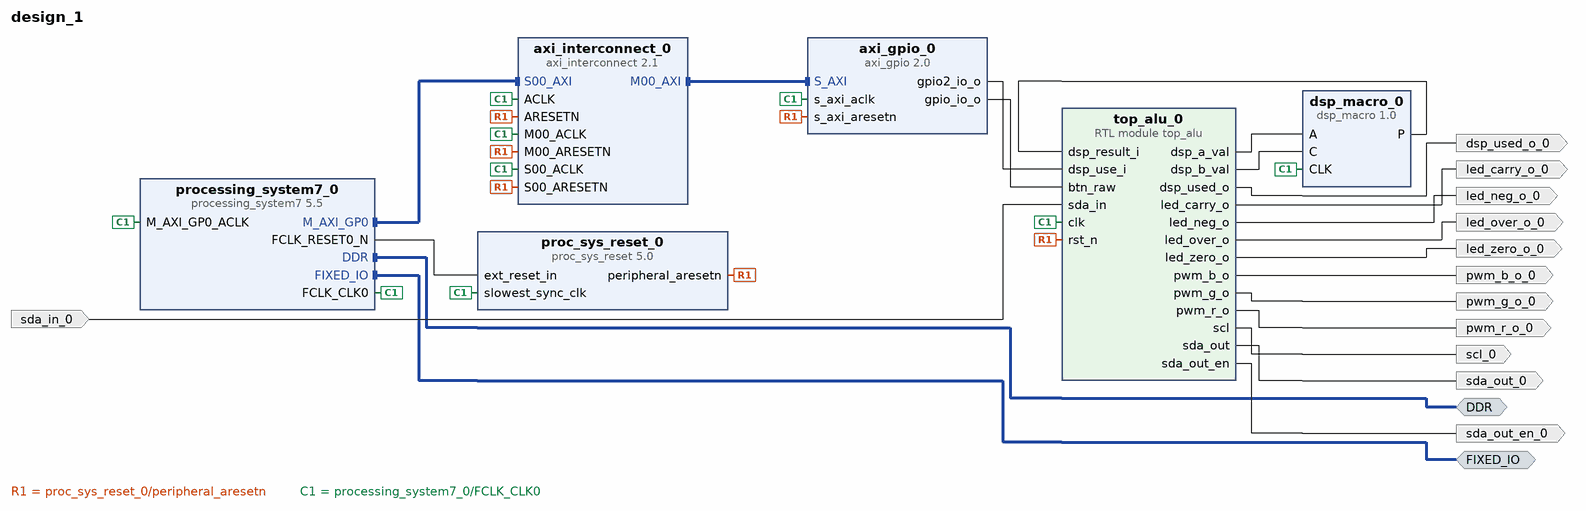
[diagram p0: block diagram of the top level]
# Vivado block design design_1, xc7z010clg400-1, Vivado 2025.1
create_bd_design design_1

create_bd_intf_port -mode Master -vlnv xilinx.com:interface:ddrx_rtl:1.0 DDR
create_bd_intf_port -mode Master -vlnv xilinx.com:display_processing_system7:fixedio_rtl:1.0 FIXED_IO
create_bd_port -dir O pwm_r_o_0
create_bd_port -dir O pwm_g_o_0
create_bd_port -dir O led_neg_o_0
create_bd_port -dir O led_zero_o_0
create_bd_port -dir O led_over_o_0
create_bd_port -dir O led_carry_o_0
create_bd_port -dir O pwm_b_o_0
create_bd_port -dir O scl_0
create_bd_port -dir O sda_out_en_0
create_bd_port -dir I sda_in_0
create_bd_port -dir O sda_out_0
create_bd_port -dir O dsp_used_o_0

create_bd_cell -type ip -vlnv xilinx.com:ip:axi_interconnect:2.1 axi_interconnect_0
set_property -dict {CONFIG.NUM_MI 1} [get_bd_cells axi_interconnect_0]
create_bd_cell -type ip -vlnv xilinx.com:ip:axi_gpio:2.0 axi_gpio_0
set_property -dict [list \
  CONFIG.C_ALL_OUTPUTS_2 0 \
  CONFIG.C_GPIO2_WIDTH 2 \
  CONFIG.C_GPIO_WIDTH 6 \
  CONFIG.C_IS_DUAL 1 \
] [get_bd_cells axi_gpio_0]
create_bd_cell -type ip -vlnv xilinx.com:ip:proc_sys_reset:5.0 proc_sys_reset_0
create_bd_cell -type module -reference top_alu top_alu_0
create_bd_cell -type ip -vlnv xilinx.com:ip:processing_system7:5.5 processing_system7_0
# 1 more settings of processing_system7_0 are not shown: defaults, MIO pin electricals, DDR timing, and values the tool derives
create_bd_cell -type ip -vlnv xilinx.com:ip:dsp_macro:1.0 dsp_macro_0
set_property -dict [list \
  CONFIG.a_width 8 \
  CONFIG.areg_3 false \
  CONFIG.areg_4 false \
  CONFIG.breg_3 false \
  CONFIG.breg_4 false \
  CONFIG.c_width 8 \
  CONFIG.creg_3 false \
  CONFIG.creg_4 false \
  CONFIG.instruction1 A+C \
  CONFIG.output_properties User_Defined \
  CONFIG.p_binarywidth 16 \
  CONFIG.p_full_width 9 \
  CONFIG.p_width 16 \
  CONFIG.pipeline_options Expert \
  CONFIG.preg_6 false \
] [get_bd_cells dsp_macro_0]

# ---- connections ----

connect_bd_intf_net [get_bd_intf_pins axi_interconnect_0/M00_AXI] [get_bd_intf_pins axi_gpio_0/S_AXI]
connect_bd_intf_net [get_bd_intf_ports DDR] [get_bd_intf_pins processing_system7_0/DDR]
connect_bd_intf_net [get_bd_intf_ports FIXED_IO] [get_bd_intf_pins processing_system7_0/FIXED_IO]
connect_bd_intf_net [get_bd_intf_pins processing_system7_0/M_AXI_GP0] [get_bd_intf_pins axi_interconnect_0/S00_AXI]
connect_bd_net [get_bd_pins axi_gpio_0/gpio2_io_o] [get_bd_pins top_alu_0/dsp_use_i]
connect_bd_net [get_bd_pins axi_gpio_0/gpio_io_o] [get_bd_pins top_alu_0/btn_raw]
connect_bd_net [get_bd_pins dsp_macro_0/P] [get_bd_pins top_alu_0/dsp_result_i]
connect_bd_net [get_bd_pins proc_sys_reset_0/peripheral_aresetn] \
  [get_bd_pins axi_interconnect_0/S00_ARESETN] [get_bd_pins axi_gpio_0/s_axi_aresetn] \
  [get_bd_pins axi_interconnect_0/M00_ARESETN] [get_bd_pins axi_interconnect_0/ARESETN] [get_bd_pins top_alu_0/rst_n]
connect_bd_net [get_bd_pins processing_system7_0/FCLK_CLK0] \
  [get_bd_pins axi_interconnect_0/S00_ACLK] [get_bd_pins proc_sys_reset_0/slowest_sync_clk] \
  [get_bd_pins axi_gpio_0/s_axi_aclk] [get_bd_pins axi_interconnect_0/M00_ACLK] [get_bd_pins axi_interconnect_0/ACLK] \
  [get_bd_pins processing_system7_0/M_AXI_GP0_ACLK] [get_bd_pins dsp_macro_0/CLK] [get_bd_pins top_alu_0/clk]
connect_bd_net [get_bd_pins processing_system7_0/FCLK_RESET0_N] [get_bd_pins proc_sys_reset_0/ext_reset_in]
connect_bd_net -net sda_in_0_1 [get_bd_ports sda_in_0] [get_bd_pins top_alu_0/sda_in]
connect_bd_net [get_bd_pins top_alu_0/dsp_a_val] [get_bd_pins dsp_macro_0/A]
connect_bd_net [get_bd_pins top_alu_0/dsp_b_val] [get_bd_pins dsp_macro_0/C]
connect_bd_net [get_bd_pins top_alu_0/dsp_used_o] [get_bd_ports dsp_used_o_0]
connect_bd_net [get_bd_pins top_alu_0/led_carry_o] [get_bd_ports led_carry_o_0]
connect_bd_net [get_bd_pins top_alu_0/led_neg_o] [get_bd_ports led_neg_o_0]
connect_bd_net [get_bd_pins top_alu_0/led_over_o] [get_bd_ports led_over_o_0]
connect_bd_net [get_bd_pins top_alu_0/led_zero_o] [get_bd_ports led_zero_o_0]
connect_bd_net [get_bd_pins top_alu_0/pwm_b_o] [get_bd_ports pwm_b_o_0]
connect_bd_net [get_bd_pins top_alu_0/pwm_g_o] [get_bd_ports pwm_g_o_0]
connect_bd_net [get_bd_pins top_alu_0/pwm_r_o] [get_bd_ports pwm_r_o_0]
connect_bd_net [get_bd_pins top_alu_0/scl] [get_bd_ports scl_0]
connect_bd_net [get_bd_pins top_alu_0/sda_out] [get_bd_ports sda_out_0]
connect_bd_net [get_bd_pins top_alu_0/sda_out_en] [get_bd_ports sda_out_en_0]

# ---- address map ----
assign_bd_address -offset 0x41200000 -range 64K -target_address_space [get_bd_addr_spaces processing_system7_0/Data] [get_bd_addr_segs axi_gpio_0/S_AXI/Reg]

validate_bd_design
save_bd_design
